# EAGLE design RAMPS_1.4.2.3 (EAGLE 7.5.0)
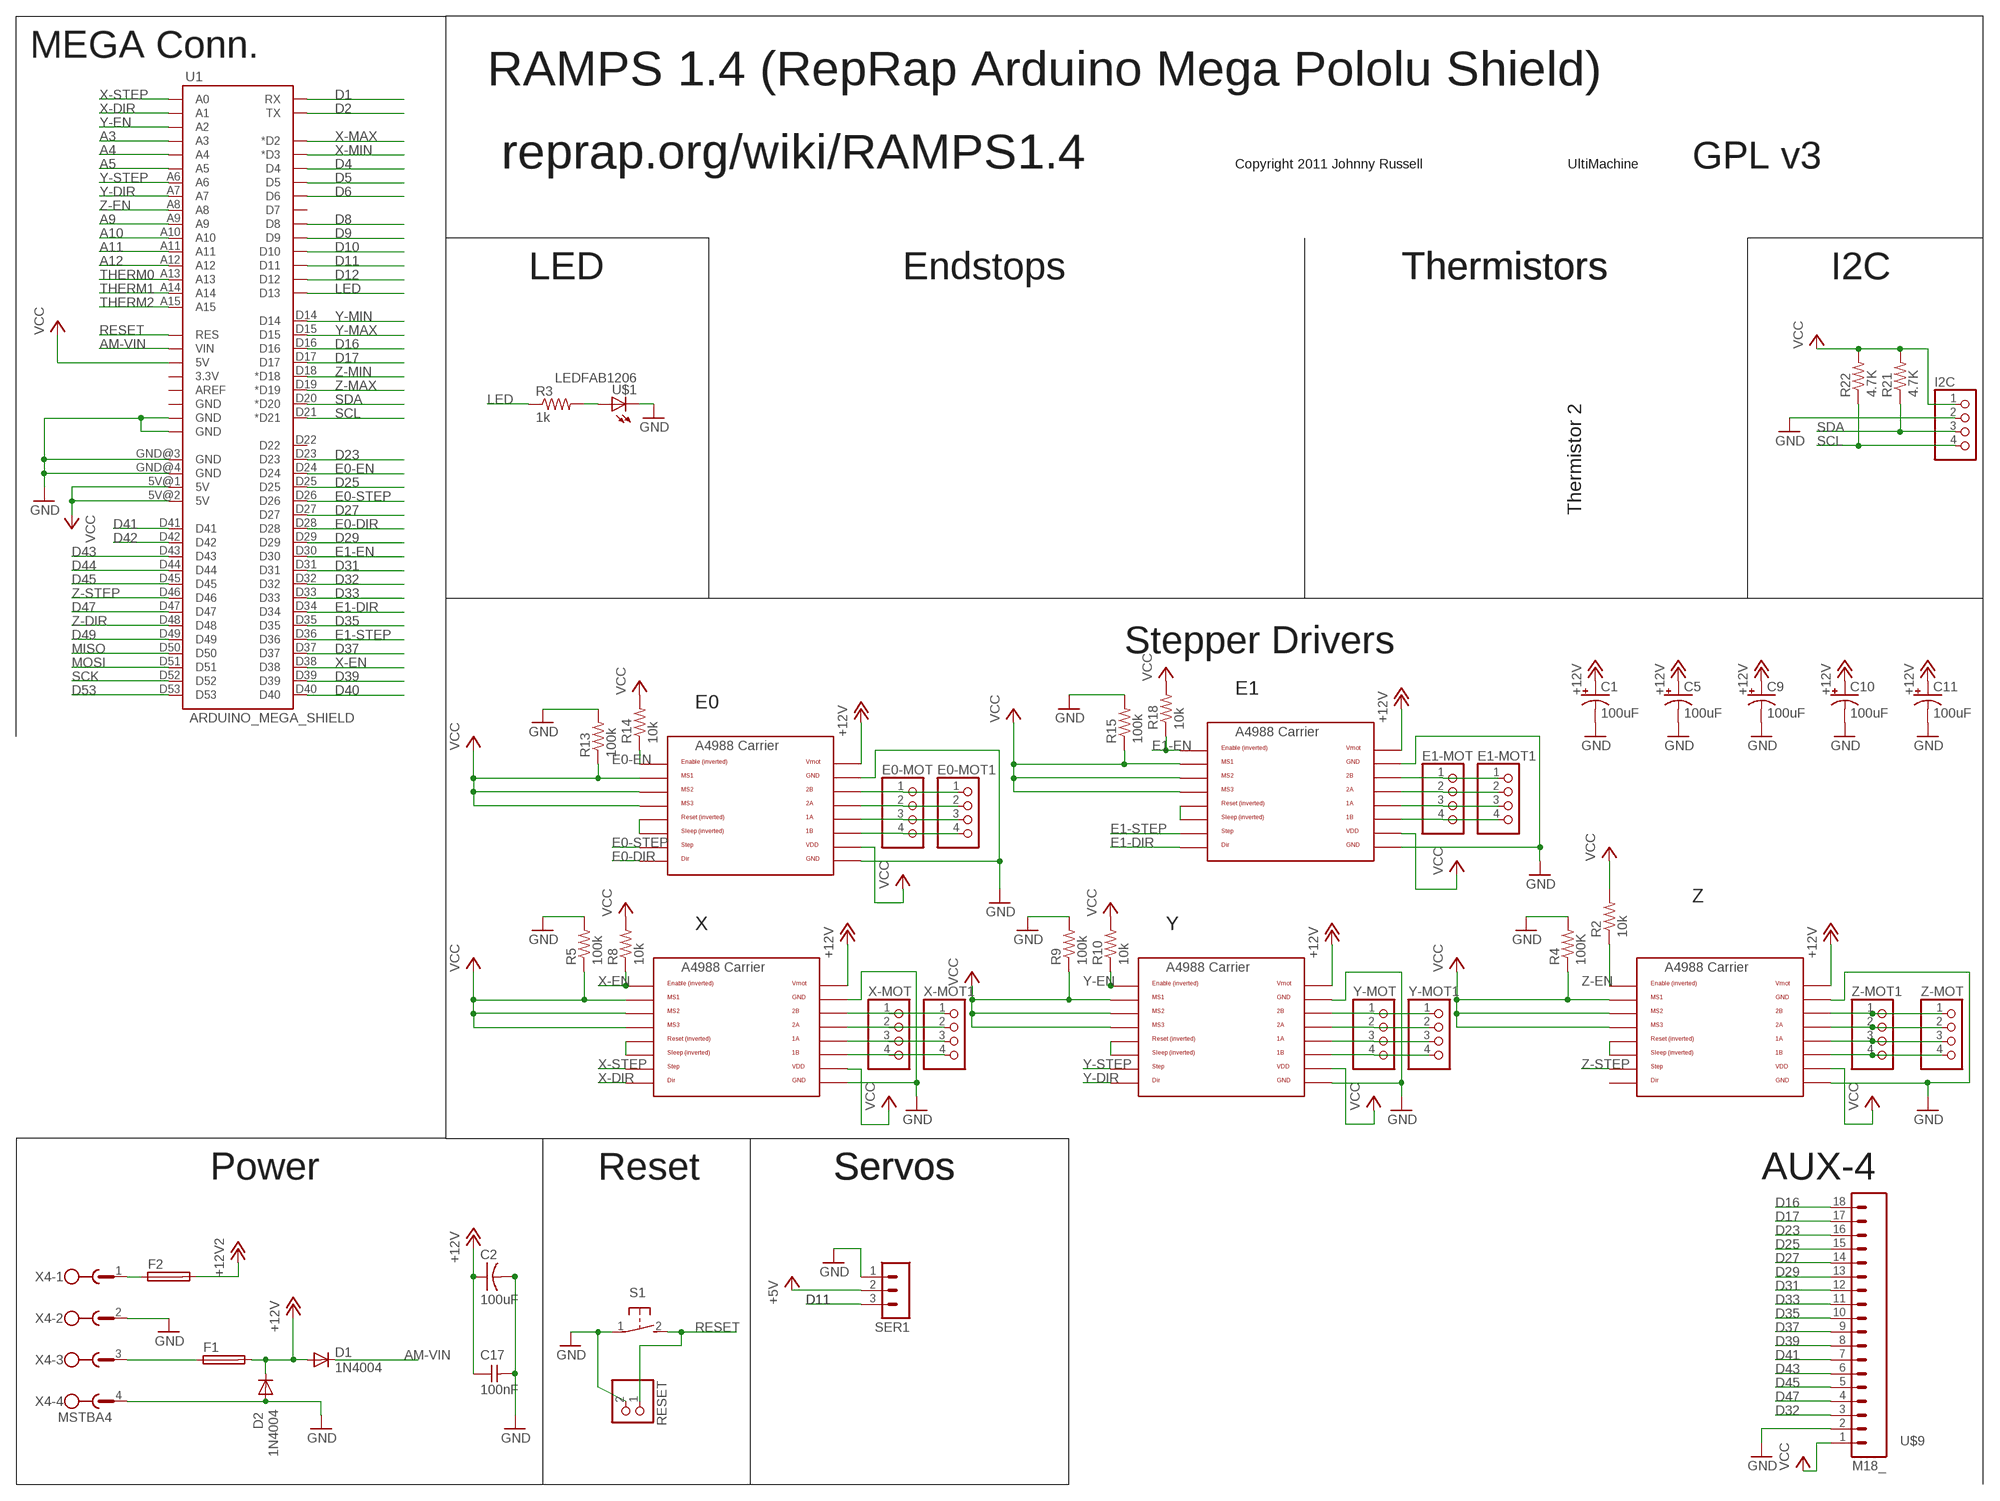
[diagram p0: schematic, sheet 1]

## Parts
C1  100uF  CPOL-US153CLV-0605  [153CLV-0605]
C2  100uF  CAP-US1206FAB  [C1206FAB]
C5  100uF  CPOL-US153CLV-0605  [153CLV-0605]
C9  100uF  CPOL-US153CLV-0605  [153CLV-0605]
C10  100uF  CPOL-US153CLV-0605  [153CLV-0605]
C11  100uF  CPOL-US153CLV-0605  [153CLV-0605]
C17  100nF  CAP-UNPOLARIZEDFAB  [C1206FAB]
D1  1N4004  [DO41-10]
D2  1N4004  [DO41-10]
E0-MOT  PINHD-1X4  [1X04]
E0-MOT1  PINHD-1X4  [1X04]
E1-MOT  PINHD-1X4  [1X04]
E1-MOT1  PINHD-1X4  [1X04]
F1  FUSE_MCCQ-122  [FUSE_MCCQ-122]
F2  FUSE_MCCQ-122  [FUSE_MCCQ-122]
I2C  PINHD-1X4  [1X04]
R2  10k  RES-US1206FAB  [R1206FAB]
R3  1k  RES-US1206FAB  [R1206FAB]
R4  100K  RES-US1206FAB  [R1206FAB]
R5  100k  RES-US1206FAB  [R1206FAB]
R8  10k  RES-US1206FAB  [R1206FAB]
R9  100k  RES-US1206FAB  [R1206FAB]
R10  10k  RES-US1206FAB  [R1206FAB]
R13  100k  RES-US1206FAB  [R1206FAB]
R14  10k  RES-US1206FAB  [R1206FAB]
R15  100k  RES-US1206FAB  [R1206FAB]
R18  10k  RES-US1206FAB  [R1206FAB]
R21  4.7K  R-US_R0805  [R0805]
R22  4.7K  R-US_R0805  [R0805]
RESET  PINHD-2  [PINHD-2]
S1  31-XX  [B3F-31XX]
SER1  3PIN-HEADER  [3PIN-HEADER]
U1  ARDUINO_MEGA_SHIELD  [ARDUINO_MEGA_SHIELD]
U$1  LEDFAB1206  [LED1206FAB]
U$4  A4988BREAKOUT  [A4988BREAKOUT]
U$5  A4988BREAKOUT  [A4988BREAKOUT]
U$6  A4988BREAKOUT  [A4988BREAKOUT]
U$7  A4988BREAKOUT  [A4988BREAKOUT]
U$8  A4988BREAKOUT  [A4988BREAKOUT]
U$9  M18_  [1X18]
X4  MSTBA4  [MSTBA4]
X-MOT  PINHD-1X4  [1X04]
X-MOT1  PINHD-1X4  [1X04]
Y-MOT  PINHD-1X4  [1X04]
Y-MOT1  PINHD-1X4  [1X04]
Z-MOT  PINHD-1X4  [1X04]
Z-MOT1  PINHD-1X4  [1X04]

## Nets
+5V: SER1.2
+12V: C1.+ C2.1 C5.+ C9.+ C10.+ C11.+ C17.1 D1.A D2.C F1.2-1 F1.2-2 U$4.VMOT U$5.VMOT U$6.VMOT U$7.VMOT U$8.VMOT
+12V2: F2.2-1 F2.2-2
A3: U1.A3
A4: U1.A4
A5: U1.A5
A9: U1.A9
A10: U1.A10
A11: U1.A11
A12: U1.A12
AM-VIN: D1.C U1.VIN
D1: U1.RX
D2: U1.TX
D4: U1.D4
D5: U1.D5
D6: U1.D6
D8: U1.D8
D9: U1.D9
D10: U1.D10
D11: SER1.3 U1.D11
D12: U1.D12
D16: U1.D16 U$9.18
D17: U1.D17 U$9.17
D23: U1.D23 U$9.16
D25: U1.D25 U$9.15
D27: U1.D27 U$9.14
D29: U1.D29 U$9.13
D31: U1.D31 U$9.12
D32: U1.D32 U$9.3
D33: U1.D33 U$9.11
D35: U1.D35 U$9.10
D37: U1.D37 U$9.9
D39: U1.D39 U$9.8
D40: U1.D40
D41: U1.D41 U$9.7
D42: U1.D42
D43: U1.D43 U$9.6
D44: U1.D44
D45: U1.D45 U$9.5
D47: U1.D47 U$9.4
D49: U1.D49
D53: U1.D53
E0-DIR: U1.D28 U$4.DIR
E0-EN: R14.1 U1.D24 U$4.EN
E0-STEP: U1.D26 U$4.STEP
E1-DIR: U1.D34 U$5.DIR
E1-EN: R18.1 U1.D30 U$5.EN
E1-STEP: U1.D36 U$5.STEP
GND: C1.- C2.2 C5.- C9.- C10.- C11.- C17.2 D2.A I2C.2 R4.2 R5.2 R9.2 R13.2 R15.2 RESET.2 S1.1(P) SER1.1 U1.GND@0(GND) U1.GND@1(GND) U1.GND@3(GND) U1.GND@4(GND) U$1.2(C) U$4.GND U$4.GND@0(GND) U$5.GND U$5.GND@0(GND) U$6.GND U$6.GND@0(GND) U$7.GND U$7.GND@0(GND) U$8.GND U$8.GND@0(GND) U$9.2 X4.2 X4.4
LED: R3.1 U1.D13
MISO: U1.D50
MOSI: U1.D51
N$3: E0-MOT1.1 E0-MOT.1 U$4.2B
N$4: E0-MOT1.2 E0-MOT.2 U$4.2A
N$8: U$4.RST U$4.SLP(SLEEP)
N$10: E0-MOT1.3 E0-MOT.3 U$4.1A
N$11: E0-MOT1.4 E0-MOT.4 U$4.1B
N$12: E1-MOT1.1 E1-MOT.1 U$5.2B
N$13: E1-MOT1.2 E1-MOT.2 U$5.2A
N$16: E1-MOT1.3 E1-MOT.3 U$5.1A
N$18: E1-MOT1.4 E1-MOT.4 U$5.1B
N$20: U$6.RST U$6.SLP(SLEEP)
N$21: U$6.2B X-MOT1.1 X-MOT.1
N$22: U$6.2A X-MOT1.2 X-MOT.2
N$23: U$7.RST U$7.SLP(SLEEP)
N$24: U$5.RST U$5.SLP(SLEEP)
N$26: U$6.1A X-MOT1.3 X-MOT.3
N$27: U$6.1B X-MOT1.4 X-MOT.4
N$28: U$7.2B Y-MOT1.1 Y-MOT.1
N$29: U$7.2A Y-MOT1.2 Y-MOT.2
N$30: U$7.1A Y-MOT1.3 Y-MOT.3
N$36: U$7.1B Y-MOT1.4 Y-MOT.4
N$38: U$8.RST U$8.SLP(SLEEP)
N$41: U$8.2B Z-MOT1.1 Z-MOT.1
N$42: U$8.2A Z-MOT1.2 Z-MOT.2
N$43: U$8.1A Z-MOT1.3 Z-MOT.3
N$44: U$8.1B Z-MOT1.4 Z-MOT.4
N$46: R3.2 U$1.1(A)
N$53: F2.1-1 F2.1-2 X4.1
N$54: F1.1-1 F1.1-2 X4.3
RESET: RESET.1 S1.2(S) U1.RES
SCK: U1.D52
SCL: I2C.4 R22.1 U1.D21(*D21)
SDA: I2C.3 R21.1 U1.D20(*D20)
THERM0: U1.A13
THERM1: U1.A14
THERM2: U1.A15
VCC: I2C.1 R2.2 R4.1 R5.1 R8.2 R9.1 R10.2 R13.1 R14.2 R15.1 R18.2 R21.2 R22.2 U1.5V@0(5V) U1.5V@1(5V) U1.5V@2(5V) U$4.MS1 U$4.MS2 U$4.MS3 U$4.VDD U$5.MS1 U$5.MS2 U$5.MS3 U$5.VDD U$6.MS1 U$6.MS2 U$6.MS3 U$6.VDD U$7.MS1 U$7.MS2 U$7.MS3 U$7.VDD U$8.MS1 U$8.MS2 U$8.MS3 U$8.VDD U$9.1
X-DIR: U1.A1 U$6.DIR
X-EN: R8.1 U1.D38 U$6.EN
X-MAX: U1.D2(*D2)
X-MIN: U1.D3(*D3)
X-STEP: U1.A0 U$6.STEP
Y-DIR: U1.A7 U$7.DIR
Y-EN: R10.1 U1.A2 U$7.EN
Y-MAX: U1.D15
Y-MIN: U1.D14
Y-STEP: U1.A6 U$7.STEP
Z-DIR: U1.D48
Z-EN: R2.1 U1.A8 U$8.EN
Z-MAX: U1.D19(*D19)
Z-MIN: U1.D18(*D18)
Z-STEP: U1.D46 U$8.STEP
Unconnected: U1.3.3V U1.AREF U1.D7 U1.D22 U1.GND@2(GND) U$8.DIR

## Notes on the sheet
- MEGA Conn.
- RAMPS 1.4 (RepRap Arduino Mega Pololu Shield)
- reprap.org/wiki/RAMPS1.4 | Copyright 2011 Johnny Russell | UltiMachine | GPL v3
- LED | Endstops | Thermistors | Thermistors | I2C
- Thermistor 2
- Stepper Drivers
- E1
- E0
- Z
- X | Y
- Power | Reset | Servos | Servos | AUX-4

## Library data of the parts
C1 C5 C9-C11 = adafruit:CPOL-US: POLARIZED CAPACITOR, American symbol
C2 = fab:CAP-US
C17 = fab:CAP-UNPOLARIZED
D1 D2 = diode:1N4004: DIODE general purpose rectifier, 1 A
E0-MOT E0-MOT1 E1-MOT E1-MOT1 I2C X-MOT X-MOT1 Y-MOT Y-MOT1 Z-MOT Z-MOT1 = RepRapjr:PINHD-1X4: PIN HEADER
F1 F2 = myLib:FUSE_MCCQ-122
R2-R5 R8-R10 R13-R15 R18 = fab:RES-US: Resistor (US Symbol) Variants with postfix FAB are widened to allow the routing of internal traces
R21 R22 = adafruit:R-US_: RESISTOR, American symbol
RESET = myLib:PINHD-2
S1 = switch-omron:31-XX: OMRON SWITCH; MPN: B3F-3100; OC_FARNELL: 959704; OC_NEWARK: 36M3582
SER1 = ultimachine:3PIN-HEADER: PIN HEADER
U1 = RepRapjr:ARDUINO_MEGA_SHIELD
U$1 = fab:LED: LED
U$4-U$8 = RepRapjr:A4988BREAKOUT
U$9 = SparkFun:M18
X4 = con-phoenix-508:MSTBA4: PHOENIX

## Board
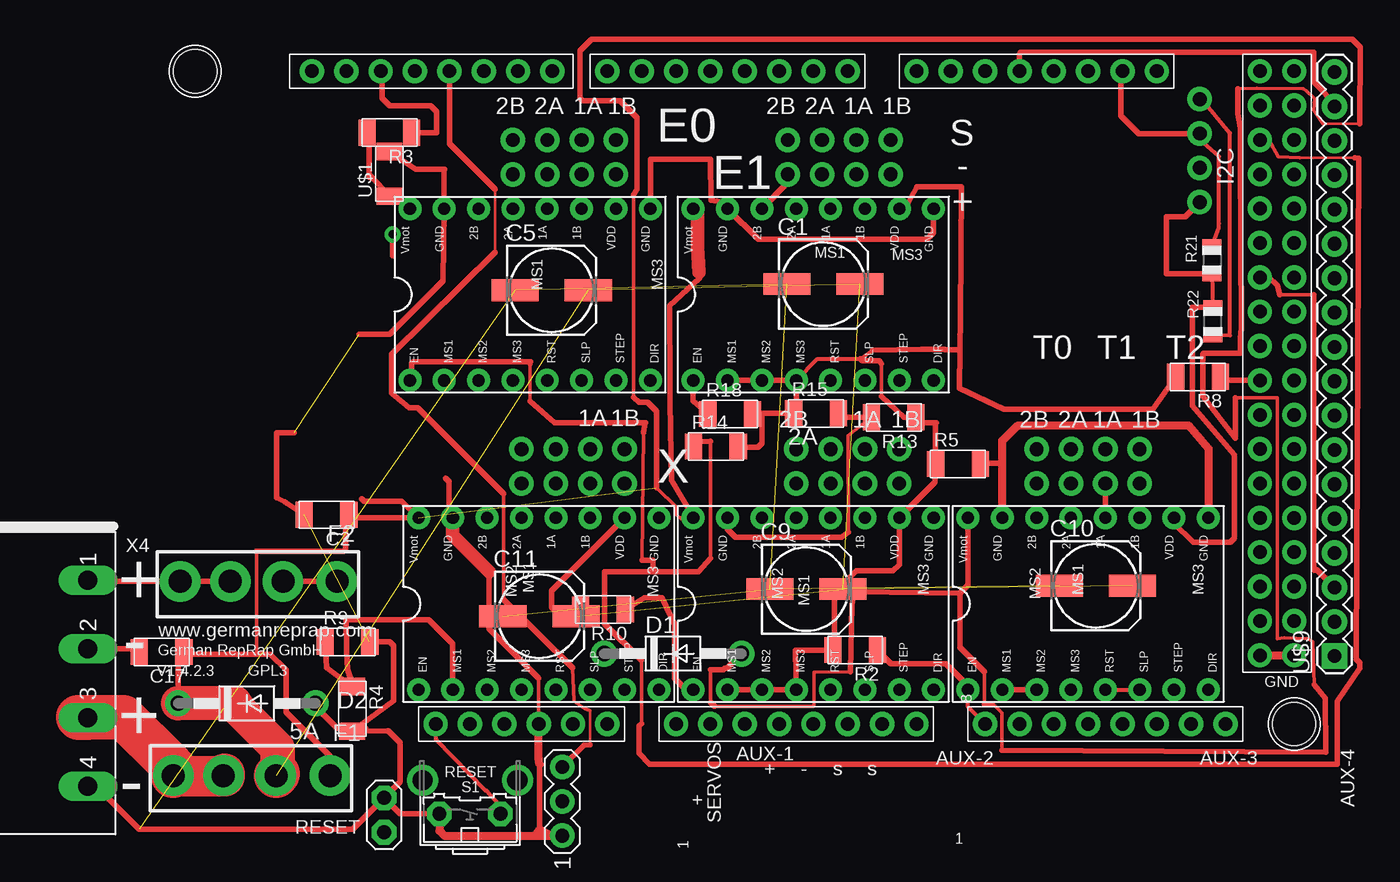
[diagram p1: board, top side]
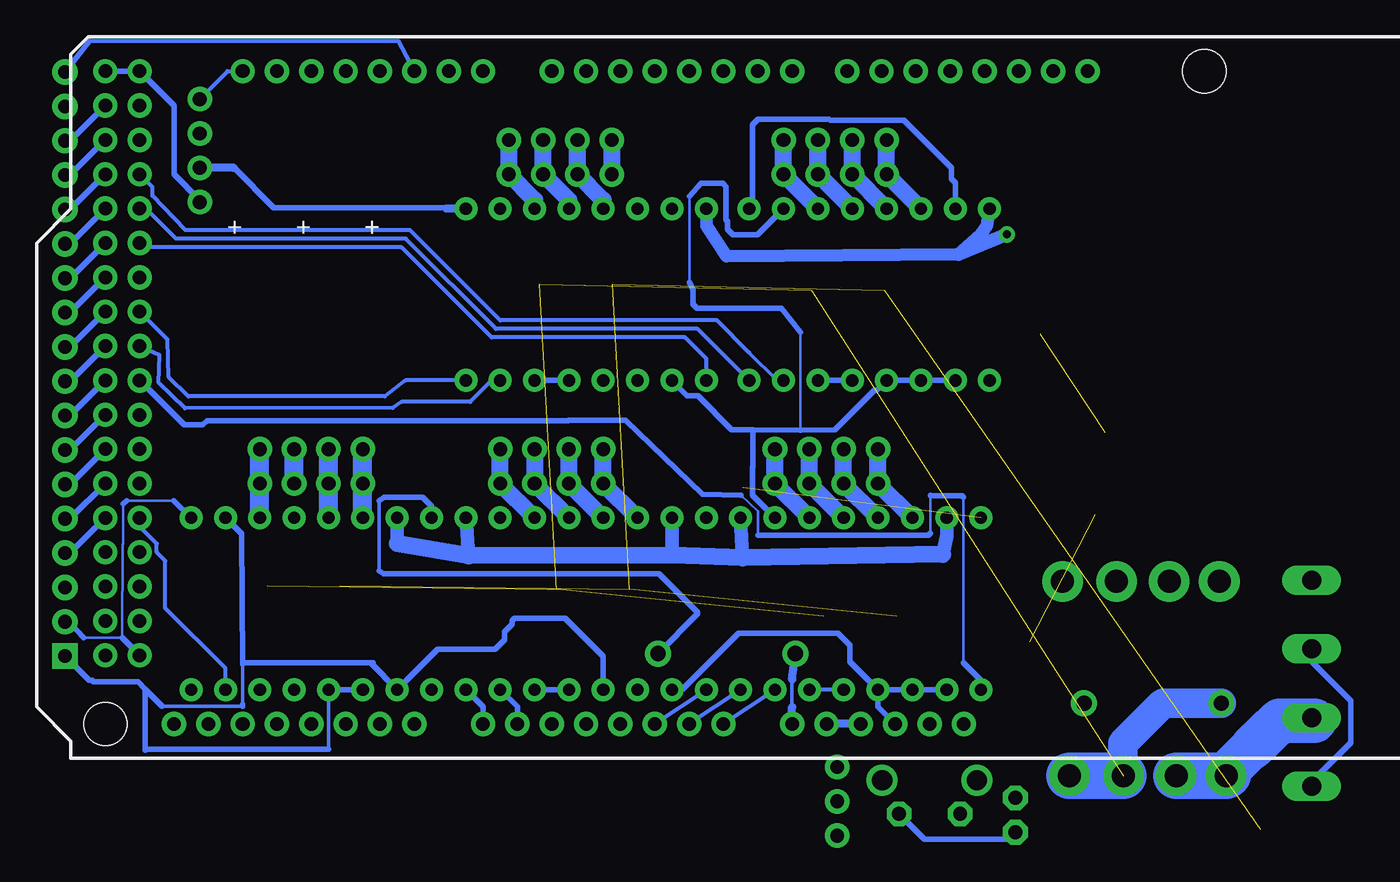
[diagram p2: board, bottom side, seen from below]

No outline drawn. Coordinates in mm, seen from the top.
Copper layers (1*16): Top 0.035mm / dielectric 1.6mm / Bottom 0.035mm
Design rules "PCB-CART *": minimum track width 0.2mm, minimum drill 0.4mm, track to track 16mil, track to pad 16mil, pad to pad 16mil, via to via 16mil, smd to smd 16mil, copper to edge 0.2mm, drill to drill 0.2mm, minimum pad ring 0.4mm, minimum via ring 0.3mm, stop-mask expansion 3mil, vias tented up to drill 0.5mm, thermal gap 12mil

### Footprints (pad centres in the part's own frame; a part is rotated, then mirrored left to right if it is on the bottom)
153CLV-0605 = smd 3.5 x 1.6: + 2.7,0; - -2.7,0
C1206FAB = smd 1.27 x 1.905: 1 -1.651,0; 2 1.651,0
DO41-10 = drill 1.118: A 5.08,0; C -5.08,0
1X04 = drill 1.016: 1 -2.54,0; 2 0,0; 3 2.54,0; 4 5.08,0
FUSE_MCCQ-122 = drill 1.7 pad 3: 1-1 -6.7,0; 1-2 -3,0; 2-1 4.9,0; 2-2 0.9,0
R1206FAB = smd 1.27 x 1.905: 1 -1.651,0; 2 1.651,0
R0805 = smd 1.1 x 1.4: 1 -1,0; 2 1,0
PINHD-2 = drill 1.016 octagon: 1 -1.27,0; 2 1.27,0
B3F-31XX = drill 1.016 octagon: 1 -2.261,-1.245; 2 2.261,-1.245 | drill 1.499 pad 2.159: 3 -3.505,1.245; 4 3.505,1.245
3PIN-HEADER = drill 1.016: 1 -2.54,0; 2 0,0; 3 2.54,0
ARDUINO_MEGA_SHIELD = drill 1 pad 1.422: 3.3V 35.56,2.54; 5V@0 38.1,2.54; 5V@1 93.98,50.8; 5V@2 96.52,50.8; A0 50.8,2.54; A1 53.34,2.54; A2 55.88,2.54; A3 58.42,2.54; A4 60.96,2.54; A5 63.5,2.54; A6 66.04,2.54; A7 68.58,2.54; A8 73.66,2.54; A9 76.2,2.54; A10 78.74,2.54; A11 81.28,2.54; A12 83.82,2.54; A13 86.36,2.54; A14 88.9,2.54; A15 91.44,2.54; AREF 23.876,50.8; D2 58.42,50.8; D3 55.88,50.8; D4 53.34,50.8; D5 50.8,50.8; D6 48.26,50.8; D7 45.72,50.8; D8 41.656,50.8; D9 39.116,50.8; D10 36.576,50.8; D11 34.036,50.8; D12 31.496,50.8; D13 28.956,50.8; D14 68.58,50.8; D15 71.12,50.8; D16 73.66,50.8; D17 76.2,50.8; D18 78.74,50.8; D19 81.28,50.8; D20 83.82,50.8; D21 86.36,50.8; D22 93.98,48.26; D23 96.52,48.26; D24 93.98,45.72; D25 96.52,45.72; D26 93.98,43.18; D27 96.52,43.18; D28 93.98,40.64; D29 96.52,40.64; D30 93.98,38.1; D31 96.52,38.1; D32 93.98,35.56; D33 96.52,35.56; D34 93.98,33.02; D35 96.52,33.02; D36 93.98,30.48; D37 96.52,30.48; D38 93.98,27.94; D39 96.52,27.94; D40 93.98,25.4; D41 96.52,25.4; D42 93.98,22.86; D43 96.52,22.86; D44 93.98,20.32; D45 96.52,20.32; D46 93.98,17.78; D47 96.52,17.78; D48 93.98,15.24; D49 96.52,15.24; D50 93.98,12.7; D51 96.52,12.7; D52 93.98,10.16; D53 96.52,10.16; GND@0 40.64,2.54; GND@1 43.18,2.54; GND@2 26.416,50.8; GND@3 93.98,7.62; GND@4 96.52,7.62; RES 33.02,2.54; RX 63.5,50.8; TX 60.96,50.8; VIN 45.72,2.54 | hole 3.2: 96.52,2.54; 15.24,50.8
LED1206FAB = smd 1.27 x 1.905: 1 -1.651,0; 2 1.651,0
A4988BREAKOUT = drill 0.9: 1A 8.89,1.27; 1B 11.43,1.27; 2A 6.35,1.27; 2B 3.81,1.27; DIR 16.51,-11.43; EN -1.27,-11.43; GND 16.51,1.27; GND@0 1.27,1.27; MS1 1.27,-11.43; MS2 3.81,-11.43; MS3 6.35,-11.43; RST 8.89,-11.43; SLP 11.43,-11.43; STEP 13.97,-11.43; VDD 13.97,1.27; VMOT -1.27,1.27
1X18 = drill 1.016 pad 1.88 square: 1 0,0 | drill 1.016 pad 1.88: 2 2.54,0; 3 5.08,0; 4 7.62,0; 5 10.16,0; 6 12.7,0; 7 15.24,0; 8 17.78,0; 9 20.32,0; 10 22.86,0; 11 25.4,0; 12 27.94,0; 13 30.48,0; 14 33.02,0; 15 35.56,0; 16 38.1,0; 17 40.64,0; 18 43.18,0
MSTBA4 = drill 1.397 long: 1 -7.62,5.08; 2 -2.54,5.08; 3 2.54,5.08; 4 7.62,5.08

### Placement (x,y rotation side)
C1  61.7,50.3 0 top
C2  24.95,33.25 180 top
C5  41.6,49.85 0 top
C9  60.45,27.75 0 top
C10  81.85,28 0 top
C11  40.7,25.75 0 top
C17  12.75,23.1 180 top
D1  50.57,22.99 0 top
D2  19.05,19.3 0 top
E0-MOT  41.27,60.96 0 top
E0-MOT1  41.27,58.42 0 top
E1-MOT  61.59,60.96 0 top
E1-MOT1  61.59,58.42 0 top
F1  20.32,13.97 0 top
F2  20.83,28.32 0 top
I2C  89.53,58.9 90 top
R2  64.05,23.25 180 top
R3  29.6,61.5 180 top
R4  26.85,18.9 270 top
R5  71.65,37 0 top
R8  89.4,43.45 180 top
R9  26.5,23.85 0 top
R10  45.4,26.25 180 top
R13  66.9,40.45 180 top
R14  53.75,38.3 0 top
R15  61.15,40.75 0 top
R18  54.8,40.7 0 top
R21  90.44,52.07 270 top
R22  90.49,47.54 90 top
RESET  29.21,11.05 90 top
S1  35.56,12.38 0 top
SER1  42.39,12.06 90 top
U1  0,15.24 0 top
U$1  29.6,58.45 90 top
U$4  32.38,54.61 0 top
U$5  53.34,54.61 0 top
U$6  33.02,31.75 0 top
U$7  53.34,31.75 0 top
U$8  73.66,31.75 0 top
U$9  99.5,22.8 90 top
X4  2.22,20.8 270 top
X-MOT  41.91,38.1 0 top
X-MOT1  41.91,35.56 0 top
Y-MOT  62.23,38.1 0 top
Y-MOT1  62.23,35.56 0 top
Z-MOT  80.01,38.1 0 top
Z-MOT1  80.01,35.56 0 top

### Tracks (layer width: path | path; a pad name or v marks a point on that pad's centre or on a via)
+12V  (via drill 0.6)  (6 unrouted)
  Top 0.203: 101.35,62.15 98.65,62.15
  Top 0.254: 53.35,21.8 53.35,19.4 | 53.65,19.1 61,19.1 61,21.6 63.7,21.65 | 51.82,32.95 51.15,32.95 50.85,33.25 50.85,33.8 49.35,35.25 | 47.65,41.95 47.65,56.9 | 98.65,62.15 97.95,63.15 98.05,64 97.4,64.6 97.2,64.75 97.15,64.75 93.75,64.8 92.35,64.75 | 92.15,41.9 95.25,41.9 95.25,24.1 95.8,24.15 97.55,24.1 97.9,23.85 98,20.7 | 74.9,15.85 74.9,18.6 74.3,19.2 73.65,19.2 | 73.6,19.25 73.6,21.65 | 19.8,30.5 19.8,22.95
  Top 0.406: U$6.VMOT 31.59,32.86 | U$7.VMOT 52.1,33.05 50.45,35.8 50.35,41.55 50.35,42.95 50.3,48.7 52.55,50.74 52.49,51.16 | D2.C 13.97,22.67 C17.1 14.55,22.95 19.8,22.95 20.8,22.95 21.95,21.8 21.95,18.65 25.22,15.38 F1.2-1 | D1.A 54.56,21.9 54.4,21.9 54.3,21.8 53.35,21.8 | 53.35,19.4 53.65,19.1 | 63.7,21.65 63.8,26.6 63.95,27.55 71.8,27.45 | 71.8,27.45 72.39,28.04 U$8.VMOT | 51.91,32.86 51.82,32.95 | 49.35,35.25 49.35,40.9 48.7,41.55 48.05,41.55 47.65,41.95 | 47.65,56.9 47.9,57.3 47.9,62.6 46.65,63.85 43.9,63.85 43.7,64.05 43.7,67.55 44.55,68.4 100.8,68.4 101.4,67.8 101.35,62.15 | 92.35,64.75 92.35,62.9 92.55,61.85 92.55,59.8 92.6,47 92.55,46.3 92.55,45.2 89.85,45.2 89.75,45.1 89.75,42 92.15,38.9 92.15,41.9 | 98,20.7 98.8,19.7 98.85,15.7 74.9,15.85 | 73.65,19.2 73.6,19.25 | 73.6,21.65 71.8,23.45 71.8,27.45 | C2.1 26.83,33.02 | 26.83,33.02 U$6.VMOT | 26.83,33.02 26.35,32.54 26.35,30.7 26.2,30.55 19.75,30.55 19.8,30.5 | 29.84,52.4 v29.84,53.98 | U$6.VMOT 30.52,34.25 27.75,34.25 27.55,34.45
  Top 1.016: U$7.VMOT 51.91,32.86 | U$8.VMOT 72.23,32.86 | 52.49,51.16 52.39,53.02 52.39,55.56 U$5.VMOT
  Top 2.54: D2.C 18.14,19.35 18.54,18.8 21.34,16 21.34,14.09
  Top 3.302: 21.34,14.09 F1.2-2
  Bottom 0.254: 76.25,29.1 76.25,34.3
  Bottom 0.406: D1.A 52.7,25.93 52.7,26.04 55.57,28.9 75.95,28.9 76.25,29.1 | 76.25,34.3 75.9,34.55 73.05,34.55 72.39,33.89 U$8.VMOT
  Bottom 0.914: U$4.VMOT 31.32,54.61 31.75,53.98 33.44,52.52 50.59,52.38 52.07,54.61 U$5.VMOT
  Bottom 1.016: 33.44,52.52 v29.84,53.98
  Bottom 1.27: U$6.VMOT
  Bottom 2.184: F1.2-2 21.25,16.34 18.29,19.3 D2.C
  Bottom 3.429: F1.2-2 F1.2-1
  pour Top: 51.44,32.38 51.44,31.75 52.07,33.02
+12V2
  Top 0.406: F2.2-2 F2.2-1
AM-VIN
  Bottom 0.254: 45.72,19.05 45.72,21.07
  Bottom 0.61: 45.72,21.07 D1.C | U1.VIN 45.72,19.05
D11
  Top 0.203: 44.45,16.25 44.45,18.75 | 37.4,52.65 37.4,57.3
  Top 0.254: 43.15,21.95 43.25,19.45 44,18.95 44.45,18.75 | 38.05,26.95 38.05,34.8
  Top 0.406: SER1.3 43.98,16.2 44.45,16.25 | 43.15,21.95 38.05,26.95 | 38.05,34.8 31.7,41.15 31.05,41.15 29.75,42.25 29.75,45.1 37.4,52.65 | 37.4,57.3 34.04,60.66 U1.D11
D16
  Bottom 0.305: 97.69,68.26 74.83,68.26 U1.D16
  Bottom 0.406: U$9.18 98.62,67.06 97.69,68.26
D17
  Top 0.406: U$9.17 98.7,64.54 97.95,65.25 97.95,67.45 76.25,67.45 76.2,67.3 U1.D17
D23
  Bottom 0.406: U1.D23 99.07,60.95 U$9.16
D25
  Bottom 0.406: U1.D25 99.07,58.41 U$9.15
D27
  Bottom 0.406: U1.D27 99.07,55.87 U$9.14
D29
  Bottom 0.406: U1.D29 99.07,53.33 U$9.13
D31
  Bottom 0.406: U1.D31 99.07,50.79 U$9.12
D32
  Top 0.254: 97.95,49.5 95.45,49.5
  Top 0.406: U$9.3 98.24,29.14 | 98.24,29.14 98.18,29.2 | 97.95,49.5 97.95,29.35 98.01,29.14 98.24,29.14 | 95.45,49.5 95.25,50.2 94.65,50.8 U1.D32
D33
  Bottom 0.406: U1.D33 99.07,48.25 U$9.11
D35
  Bottom 0.406: U1.D35 99.07,45.71 U$9.10
D37
  Bottom 0.406: U1.D37 99.07,43.17 U$9.9
D39
  Bottom 0.406: U1.D39 99.07,40.63 U$9.8
D41
  Bottom 0.406: U1.D41 99.07,38.09 U$9.7
D43
  Bottom 0.406: U1.D43 99.07,35.55 U$9.6
D45
  Bottom 0.406: U1.D45 99.07,33.01 U$9.5
D47
  Bottom 0.406: U1.D47 99.07,30.47 U$9.4
E0-DIR
  Bottom 0.305: U1.D28 93.5,55.88 91.28,53.66 74.3,53.66 67.63,46.99 52.7,46.99 U$4.DIR
E0-EN
  Top 0.203: 101,59.65 96.95,59.65
  Top 0.254: 53.35,38.7 53.35,30.05 | 48.25,22.5 48.25,17.8 | 96.95,59.65 95.35,59.7 94.64,60.96 | 40,44.4 40,41.65 | 48.4,39.3 48.3,29.9
  Top 0.406: 53.35,30.05 52.45,29.05 49.1,29.05 | 49.1,29.05 45.5,29.05 45.5,25.2 48.25,22.5 | 48.25,17.8 48.05,17.65 48.05,15.6 48.85,14.8 99.7,14.8 99.7,19.45 101.35,21.9 101.35,22.3 101.1,22.55 101.3,59.6 101,59.65 | 94.64,60.96 U1.D24 | R14.1 52.45,38.65 53.35,38.7 | U$4.EN 31.25,43.31 31.25,44.45 31.35,44.55 40.05,44.55 40,44.4 | 40,41.65 41.8,40.05 48.5,40.05 | 48.5,40.05 48.55,40.05 | 48.3,29.9 49.1,29.9 49.1,29.05 | 48.4,39.3 48.5,40.05
E0-STEP
  Bottom 0.254: 48.9,45.24 46.83,43.18 U$4.STEP
  Bottom 0.305: U1.D26 93.03,57.47 93.03,56.83 90.59,54.29 73.98,54.29 67.31,47.62 51.28,47.62 48.9,45.24
E1-DIR
  Bottom 0.305: U1.D34 91.92,46.2 91.82,43.42 90.39,41.99 75.83,41.99 74.3,43.18 U$5.DIR
E1-EN
  Top 0.406: R18.1 52.07,41.68 U$5.EN
  Bottom 0.305: U1.D30 93.66,53.02 74.61,53.02 67.94,46.35 53.66,46.35 52.07,44.77 U$5.EN
E1-STEP
  Bottom 0.305: U1.D36 92.51,45.05 92.56,43 90.61,41.11 75.25,41.16 74.61,41.59 69.53,41.59 67.94,43.18 U$5.STEP
GND  (7 unrouted)
  Top 0.254: U1.GND@0 40.65,21.15 | R13.2 63.5,39.1 63.55,31.95
  Top 0.406: 40.71,10.01 40.71,14.77 | RESET.2 30.39,11.14 S1.1 | U1.GND@0 | U$4.GND 48.9,56.09 48.9,59.55 53.35,59.55 53.4,56.5 54.09,56.4 U$5.GND@0 56.89,53.6 69.35,53.6 69.85,54.1 U$5.GND | R5.2 73.55,37.05 74.93,37.05 | R4.2 29.9,19.5 29.9,23.55 29.6,23.85 R9.2 | RESET.2 30.4,13.51 30.4,16.4 29.5,17.3 R4.2 | R4.2 27.85,17.45 25.75,17.45 24.13,19.07 D2.A | 40.65,21.15 36.99,24.81 36.99,29.05 | R15.2 63,40.45 R13.2 | U$1.2 31.55,58.8 33.7,58.8 33.66,58.76 U$4.GND@0 33.55,50.55 29.6,46.6 27.35,46.6 | U$6.GND@0 34,33.31 34,35.7 33.75,35.95 | C2.2 21.95,34.15 21.85,34.2 21.25,34.5 21.25,39.3 22.55,39.3 | RESET.2 26.89,10 11.1,10 7.92,13.18 X4.4 | C17.2 10.86,23.34 X4.2 | 63.55,31.95 63.05,31.6 55.2,31.6 54.61,32.19 U$7.GND@0
  Top 0.61: U1.GND@3 U1.GND@4 | U$8.GND 90.17,38.13 88.7,39.85 76.1,39.85 74.93,38.73 74.93,37.05 U$8.GND@0 | S1.1 33.3,9.88 33.66,9.53 40.32,9.53 | 40.96,9.53 40.71,10.01 | 40.71,14.77 40.64,15.24 U1.GND@0 | 40.32,9.53 40.96,9.53 | 40.96,9.53 41.59,9.53 | 41.59,9.53 SER1.1 | SER1.1 | 40.32,9.53 40.71,10.01 | 40.71,10.01 41.59,9.53
  Top 1.016: U$6.GND@0 34.29,31.75 36.99,29.05
  Bottom 0.203: 98.1,24.15 95.27,24.15 95.22,31.08 95.2,31.1 95.2,34.05 | 91.45,34.3 94.95,34.3
  Bottom 0.406: 7.46,13.34 4.4,16.4 4.4,19.5 7.22,22.32 7.22,22.38 7.3,22.45 X4.2 | U1.GND@3 95.27,24.15 | 98.1,24.15 99.09,25.19 U$9.2 | U$8.GND 91.45,34.3 | 94.95,34.3 95.2,34.05 | U$4.GND 48.65,56.12 48.65,62.1 48.25,62.5 43,62.5 42.9,62.4 37.45,62.4 33.95,58.9 33.95,58.1 33.66,57.8 U$4.GND@0 | 71.28,55.88 71.35,55.95 84.05,55.95 87,58.9
  Bottom 0.61: 87,58.9 I2C.2 | U$5.GND 71.28,55.88 | U1.GND@0 U1.GND@1
  Bottom 0.914: 7.62,13.34 7.46,13.34 X4.4 | U$6.GND@0
  Bottom 1.016: 74.93,31.11 U$8.GND@0 | 69.65,30.21 U$7.GND | 54.61,30.27 U$7.GND@0 | U$6.GND | 49.38,30.07 U$6.GND | U$6.GND@0 34.29,31.75 34.58,30.32
  Bottom 1.27: 34.58,30.32 49.38,30.07 54.61,30.27 69.65,30.21 74.93,31.11
LED
  Top 0.406: U1.D13 29.05,65.95 29.05,64.05 29.6,63.5 32.65,63.5 33.1,63.05 33.1,61.5 R3.1
N$3
  Bottom 1.27: U$4.2B E0-MOT1.1 E0-MOT.1 | E0-MOT.1
N$4
  Bottom 1.27: U$4.2A E0-MOT1.2 E0-MOT.2 | E0-MOT.2
N$8
  Bottom 0.406: U$4.RST U$4.SLP
N$10
  Bottom 1.27: U$4.1A E0-MOT1.3 E0-MOT.3 | E0-MOT.3
N$11
  Bottom 1.27: U$4.1B E0-MOT1.4 E0-MOT.4 | E0-MOT.4
N$12
  Top 0.406: U$5.2B 59.05,57.78 E1-MOT1.1
  Bottom 1.27: E1-MOT1.1 E1-MOT.1
N$13
  Bottom 1.27: U$5.2A 59.69,56.52 E1-MOT1.2 E1-MOT.2
N$16
  Bottom 1.27: U$5.1A 62.23,56.52 E1-MOT1.3 E1-MOT.3
N$18
  Bottom 1.27: U$5.1B 64.77,56.52 E1-MOT1.4 E1-MOT.4
N$20
  Bottom 0.305: U$6.RST U$6.SLP
N$21
  Bottom 1.27: U$6.2B | U$6.2B X-MOT1.1 X-MOT.1
N$22
  Bottom 1.27: U$6.2A | U$6.2A X-MOT1.2 X-MOT.2
N$23
  Bottom 0.406: U$7.RST U$7.SLP
N$24
  Bottom 0.406: U$5.RST U$5.SLP
N$26
  Bottom 1.27: U$6.1A | U$6.1A X-MOT1.3 X-MOT.3
N$27
  Bottom 1.27: U$6.1B | U$6.1B X-MOT1.4 X-MOT.4
N$28
  Bottom 1.27: U$7.2B Y-MOT1.1 Y-MOT.1
N$29
  Bottom 1.27: U$7.2A Y-MOT1.2 Y-MOT.2
N$30
  Bottom 1.27: U$7.1A Y-MOT1.3 Y-MOT.3
N$36
  Bottom 1.27: U$7.1B Y-MOT1.4 Y-MOT.4
N$38
  Top 0.305: U$8.RST U$8.SLP
N$41
  Bottom 1.422: U$8.2B Z-MOT1.1 Z-MOT.1
N$42
  Bottom 1.422: U$8.2A Z-MOT1.2 Z-MOT.2
N$43
  Top 0.406: Z-MOT1.3 U$8.1A
  Bottom 1.422: Z-MOT1.3 Z-MOT.3
N$44
  Bottom 1.422: U$8.1B Z-MOT1.4 Z-MOT.4
N$46
  Top 0.406: R3.2 28.1,61.35 28.1,58.2 28.2,58.3 U$1.1
N$53
  Top 0.406: X4.1 7.4,28.32 F2.1-1 F2.1-2
N$54
  Top 0.305: 13.46,14.43 13.46,14.73 13.3,14.9 | 13.57,13.92 16.5,13.92 | 13.46,14.43 13.46,13.92 13.57,13.92 | 13.46,14.43 9.6,18.29 | 13.57,13.92 F1.1-1 | 13.57,13.92 17.27,13.92 F1.1-2
  Top 3: 17.4,14.1 17.4,13.92 16.5,13.92 13.46,13.92
  Top 3.302: F1.1-1 13.62,14.57 13.3,14.9 9.91,18.29 9.6,18.29 6.6,18.29 6.64,18.26 X4.3
  Bottom 0.305: 13.46,13.92 13.57,13.92 F1.1-1
  Bottom 3.21: 11.72,16.04 11.76,16.04 13.4,14.4 13.4,13.99 13.46,13.92 13.8,13.92
  Bottom 3.302: 11.72,16.04 9.65,18.03 7.11,18.03
  Bottom 3.429: F1.1-2 F1.1-1
RESET
  Top 0.305: S1.2 37.82,11.71 36.77,12.87 36.77,12.82 33.05,16.63 U1.RES
  Bottom 0.406: RESET.1 29.72,9.27 35.95,9.27 S1.2
SCL
  Top 0.305: R22.1 91.76,46.51 91.76,61.46 89.69,63.98 I2C.4
  Bottom 0.305: I2C.4 87.47,66.04 U1.D21
SDA
  Top 0.305: R21.1 90.94,54.44 90.95,54.77 90.95,59.74 89.53,60.96 I2C.3
  Top 0.406: U1.D20 83.7,65.92 83.7,62.75 85.01,61.44 I2C.3
VCC
  Top 0.254: 66,44.4 66,42
  Top 0.305: R21.2 R22.2 | 65.31,45.42 64.45,44.77 61.28,44.77 U$5.MS3
  Top 0.406: U$7.MS1 U$7.MS2 U$7.MS3 59.65,23.03 59.65,23.25 R2.2 62.5,23.35 62.5,27.45 64.15,29.1 66.85,29.1 67.31,29.56 U$7.VDD 69.95,35.66 R5.1 70,40 70.05,40.05 68.95,40.05 R13.1 67.65,40.45 66,42 | R9.1 24.95,21.95 R4.1 26.8,20.95 26.5,21.8 26.45,23.15 26.4,25.45 26.45,25.5 32.5,25.5 34.29,23.71 U$6.MS1 | U$8.MS2 U$8.MS1 | 64.45,44.77 64.57,44.65 65.85,44.65 66,44.4 | U$5.MS1 U$5.MS2 U$5.MS3 59.69,40.94 R15.1 57.2,40.75 57.15,40.7 | 65.31,45.42 68.95,45.48 70.65,45.48 70.69,45.44 71.8,45.44 | R14.2 55.45,38.25 56.85,38.25 57.15,38.55 57.15,40.7 | 57.15,40.7 R18.2 | U$6.VDD 41.6,27.63 41.6,26.4 41.75,26.25 R10.2 | U$5.VDD 67.73,55.88 68.6,57.5 71.9,57.5 71.85,47.85 71.8,45.44 | R22.2 89.75,48.6 89,48.6 89,41.3 92.1,37.7 92.1,31.5 91.8,31.2 89.05,31.2 87.63,32.62 U$8.VDD | R8.2 86.05,41.05 75.05,41.05 71.75,42.6 71.8,45.44 | I2C.1 88.48,55.3 87.05,55.3 87.05,52.1 87.07,51.07 R21.2
  Bottom 0.203: 53.3,56.8 53.3,50.45 | 45.1,46.75 45.1,39.5
  Bottom 0.254: 80.01,15.91 U$8.MS3 | 92.3,19.1 86.35,19.1 | 86.35,19.25 86.35,22.2
  Bottom 0.305: I2C.1
  Bottom 0.406: U1.5V@2 U1.5V@1 91.44,63.5 91.44,58.42 89.53,56.52 | U$4.MS1 U$4.MS2 U$4.MS3 39.47,42.45 39.65,42.45 42.55,39.55 45.1,39.5 48.6,39.55 | U$9.1 97.7,21 97.5,21 97.4,20.9 94.1,20.9 93.55,20.35 | 93.55,20.35 93.55,15.85 93.5,15.9 80,15.9 80.01,15.91 | U$8.MS3 U$8.MS2 | U$7.MS3 59.69,22.79 62.5,25.6 66.25,25.6 66.45,25.4 66.45,25.15 67,24.6 67,24 67.7,23.3 71.95,23.3 U$8.MS1 76.9,22.29 76.9,22.3 | U$6.VDD 48.65,34.68 48.65,36.75 48.6,36.8 48.6,39.55 | U$4.VDD 48.28,53.95 50.1,53.95 50.5,54.35 50.5,54.95 50.6,55.05 50.6,57.5 50.85,57.75 52.45,57.75 53.3,56.8 | 53.3,50.45 53.05,49.9 53.05,48.8 52.75,48.5 46.5,48.5 45.1,46.75 | U$5.MS1 53.48,42.05 52.7,42.05 50.2,39.55 48.6,39.55 | U1.5V@0 39.37,19.05 U$6.MS3 | U$6.MS1 U$6.MS2 U$6.MS3 | 93.55,20.35 92.3,19.1 | 86.35,19.1 86.35,19.25 | 76.9,22.3 86.2,22.3 86.35,22.2 86.45,31.84 U$8.VDD | 76.9,22.3 76.7,22.3 | U$6.MS3 41.45,22.4 41.45,23.6 42.35,24.5 49.7,24.5 53.88,20.32 U$7.MS1
  Bottom 0.61: I2C.1 89.53,56.52
X-DIR
  Bottom 0.305: U$6.DIR U1.A1
X-EN
  Top 0.406: R8.1 91.32,43.18 U1.D38
  Bottom 0.203: 49.5,34.7 48.25,33.5 48.25,31.75 | 35.5,31.9 35.5,34.7 | 33.05,34.55 33.05,22.3
  Bottom 0.406: U1.D38 90.7,39.9 89.3,39.9 89,40.2 62.3,40.2 62.25,40.25 58.05,40.25 52.35,34.75 49.5,34.7 | 48.25,31.75 35.65,31.75 35.5,31.9 | 35.5,34.7 35.45,34.65 33.15,34.65 33.05,34.55 | 33.05,22.3 31.75,21 U$6.EN
X-STEP
  Bottom 0.305: U$6.STEP U1.A0
Y-DIR
  Bottom 0.305: U1.A7
  Bottom 0.406: U1.A7 68.58,19.05 U$7.DIR
Y-EN
  Top 0.406: R10.1 48.45,27.1 49.75,27.1 50.7,25.15 50.7,21.15 51.53,20.32 U$7.EN
  Bottom 0.305: U$7.EN U1.A2
Y-STEP
  Bottom 0.305: U1.A6
  Bottom 0.406: U1.A6 66.04,19.05 U$7.STEP
Z-EN
  Top 0.305: U1.A8 72.39,19.05 U$8.EN
  Top 0.406: R2.1 66.7,22.25 70.75,22.25 72.39,20.61 U$8.EN
Z-STEP
  Bottom 0.305: U$8.STEP 87.63,21.91 92.08,26.35 92.08,29.84 92.71,30.48 92.71,31.11 93.82,32.23 93.82,32.86 U1.D46
(copper drawn outside any net)
  shapes: Bottom circle x1

### Text on the board
tNames: 2B | 2A | 1A | 1B | 2B | 2A | 1A | 1B | E0 | S | - | E1 | + | MS1 | MS3 | MS1 | MS3 | T0 | T1 | T2 | 1A | 1B | 2B | 2A | 1A | 1B | 2B | 2A | 1A | 1B | X | + | MS2 | MS1 | MS3 | MS2 | MS1 | MS3 | MS2 | MS1 | MS3 | www.germanreprap.com | German RepRap GmbH | - | V1.4.2.3 | GPL3 | GND | 8 | + | 5A | AUX-1 | AUX-2 | AUX-3 | RESET | + | - | s | s | - | + | AUX-4 | SERVOS | 1 | 1
bNames: + | + | + | +
Document: RAMPS 1.4.2.1 (RepRap Arduino MEGA Pololu Shield) | GPL v3 | reprap.org/wiki/RAMPS1.4 | Reversing input power, and inserting stepper drivers incorrectly will destroy electronics. | I2C | 21 | 20 | 12-35V Out | GND | 5V | - | D10 | + | AUX-4 | D16 | - | D17 | D9 | + | D23 | D25 | - | D11 | D27 | + | D29 | D31 | 12-35VDC In | D33 | + | D35 | 11A | D37 | - | D38 | D41 | + | 5A | D43 | - | D45 | SERVOS | AUX-1 | AUX-2 | AUX-3 / SPI | D11 | D6 | D5 | D4 | D47 | A9 | A11 | SCK | MISO | D32 | 5V | GND | D2 | D1 | GND | D63 | D48 | D42 | D65 | GND | D52 | D50 | 5V | 5V | 5V | 5V | 5V | GND | 5V | GND | A3 | A4 | 5V | A5 | A10 | D44 | A12 | NC | D53 | MOSI | D49 | D57 | D58 | D59 | D64 | D66 | D51 | 5V | GND | GND | GND | GND | Copyright 2011 Johnny Russell - UltiMachine
_tsilk: + | I2C | END STOPS | 21 | 1 | 20 | 1 | - | + | 1 | + | 1 | 1 | 1 | 1 | 1 | 1 | 1 | -